# Altium schematic sheet soc-io.schdoc: IO
size A4; Date: 09.27.2026; CheckedBy: BCY; DrawnBy: miaow; Revision: v1.0.0; SheetNumber: 7; SheetTotal: 18; BoardType: MAIN_PCB; Desc: Connectivity
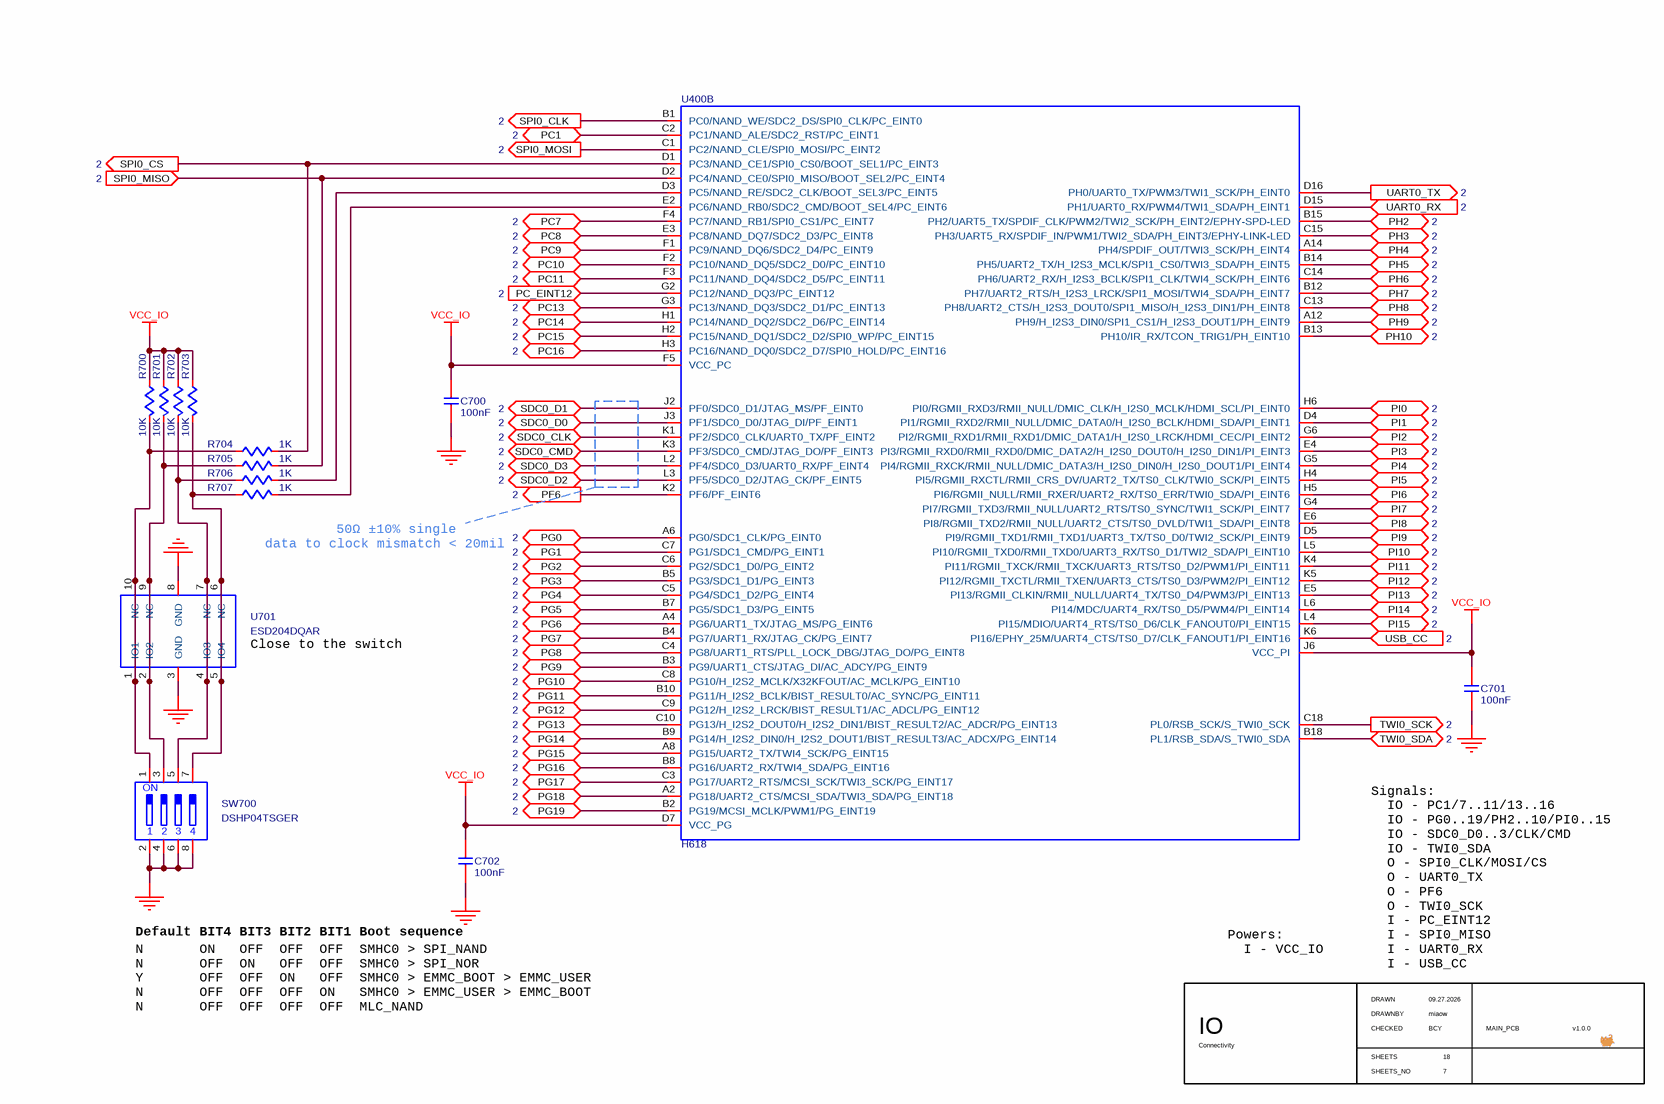
[diagram p0: soc-io.schdoc]

## Parts
C700  value 100nF  [C0201]  (hidden comment: C-NOMO)
C701  value 100nF  [C0201]  (hidden comment: C-NOMO)
C702  value 100nF  [C0201]  (hidden comment: C-NOMO)
R700  value 10K  [R0402]  (hidden comment: R)
R701  value 10K  [R0402]  (hidden comment: R)
R702  value 10K  [R0402]  (hidden comment: R)
R703  value 10K  [R0402]  (hidden comment: R)
R704  value 1K  [R0402]  (hidden comment: R)
R705  value 1K  [R0402]  (hidden comment: R)
R706  value 1K  [R0402]  (hidden comment: R)
R707  value 1K  [R0402]  (hidden comment: R)
SW700  DSHP04TSGER  [DSHP04TSGER]
U400  H618  [H618]  (part B of 4)
U701  ESD204DQAR  [ESD204DQAR]

## Ports
PC1 (bidir, see 2), PC7 (bidir, see 2), PC8 (bidir, see 2), PC9 (bidir, see 2), PC10 (bidir, see 2), PC11 (bidir, see 2), PC13 (bidir, see 2), PC14 (bidir, see 2), PC15 (bidir, see 2), PC16 (bidir, see 2), PC_EINT12 (in, see 2), PF6 (out, see 2), PG0 (bidir, see 2), PG1 (bidir, see 2), PG2 (bidir, see 2), PG3 (bidir, see 2), PG4 (bidir, see 2), PG5 (bidir, see 2), PG6 (bidir, see 2), PG7 (bidir, see 2), PG8 (bidir, see 2), PG9 (bidir, see 2), PG10 (bidir, see 2), PG11 (bidir, see 2), PG12 (bidir, see 2), PG13 (bidir, see 2), PG14 (bidir, see 2), PG15 (bidir, see 2), PG16 (bidir, see 2), PG17 (bidir, see 2), PG18 (bidir, see 2), PG19 (bidir, see 2), PH2 (bidir, see 2), PH3 (bidir, see 2), PH4 (bidir, see 2), PH5 (bidir, see 2), PH6 (bidir, see 2), PH7 (bidir, see 2), PH8 (bidir, see 2), PH9 (bidir, see 2), PH10 (bidir, see 2), PI0 (bidir, see 2), PI1 (bidir, see 2), PI2 (bidir, see 2), PI3 (bidir, see 2), PI4 (bidir, see 2), PI5 (bidir, see 2), PI6 (bidir, see 2), PI7 (bidir, see 2), PI8 (bidir, see 2), PI9 (bidir, see 2), PI10 (bidir, see 2), PI11 (bidir, see 2), PI12 (bidir, see 2), PI13 (bidir, see 2), PI14 (bidir, see 2), PI15 (bidir, see 2), SDC0_CLK (bidir, see 2), SDC0_CMD (bidir, see 2), SDC0_D0 (bidir, see 2), SDC0_D1 (bidir, see 2), SDC0_D2 (bidir, see 2), SDC0_D3 (bidir, see 2), SPI0_CLK (out, see 2), SPI0_CS (out, see 2), SPI0_MISO (in, see 2), SPI0_MOSI (out, see 2), TWI0_SCK (out, see 2), TWI0_SDA (bidir, see 2), UART0_RX (in, see 2), UART0_TX (out, see 2), USB_CC (in, see 2)

## Nets
GND: C700.2 C701.2 C702.2 SW700.2 SW700.4 SW700.6 SW700.8 U701.3(GND) U701.8(GND)
VCC_IO: C700.1 C701.1 C702.1 R700.2 R701.2 R702.2 R703.2 U400.D7(VCC_PG) U400.F5(VCC_PC) U400.J6(VCC_PI)
PC1: U400.C2(PC1/NAND_ALE/SDC2_RST/PC_EINT1) ; port PC1
PC7: U400.F4(PC7/NAND_RB1/SPI0_CS1/PC_EINT7) ; port PC7
PC8: U400.E3(PC8/NAND_DQ7/SDC2_D3/PC_EINT8) ; port PC8
PC9: U400.F1(PC9/NAND_DQ6/SDC2_D4/PC_EINT9) ; port PC9
PC10: U400.F2(PC10/NAND_DQ5/SDC2_D0/PC_EINT10) ; port PC10
PC11: U400.F3(PC11/NAND_DQ4/SDC2_D5/PC_EINT11) ; port PC11
PC13: U400.G3(PC13/NAND_DQ3/SDC2_D1/PC_EINT13) ; port PC13
PC14: U400.H1(PC14/NAND_DQ2/SDC2_D6/PC_EINT14) ; port PC14
PC15: U400.H2(PC15/NAND_DQ1/SDC2_D2/SPI0_WP/PC_EINT15) ; port PC15
PC16: U400.H3(PC16/NAND_DQ0/SDC2_D7/SPI0_HOLD/PC_EINT16) ; port PC16
PC_EINT12: U400.G2(PC12/NAND_DQ3/PC_EINT12) ; port PC_EINT12
PF6: U400.K2(PF6/PF_EINT6) ; port PF6
PG0: U400.A6(PG0/SDC1_CLK/PG_EINT0) ; port PG0
PG1: U400.C7(PG1/SDC1_CMD/PG_EINT1) ; port PG1
PG2: U400.C6(PG2/SDC1_D0/PG_EINT2) ; port PG2
PG3: U400.B5(PG3/SDC1_D1/PG_EINT3) ; port PG3
PG4: U400.C5(PG4/SDC1_D2/PG_EINT4) ; port PG4
PG5: U400.B7(PG5/SDC1_D3/PG_EINT5) ; port PG5
PG6: U400.A4(PG6/UART1_TX/JTAG_MS/PG_EINT6) ; port PG6
PG7: U400.B4(PG7/UART1_RX/JTAG_CK/PG_EINT7) ; port PG7
PG8: U400.C4(PG8/UART1_RTS/PLL_LOCK_DBG/JTAG_DO/PG_EINT8) ; port PG8
PG9: U400.B3(PG9/UART1_CTS/JTAG_DI/AC_ADCY/PG_EINT9) ; port PG9
PG10: U400.C8(PG10/H_I2S2_MCLK/X32KFOUT/AC_MCLK/PG_EINT10) ; port PG10
PG11: U400.B10(PG11/H_I2S2_BCLK/BIST_RESULT0/AC_SYNC/PG_EINT11) ; port PG11
PG12: U400.C9(PG12/H_I2S2_LRCK/BIST_RESULT1/AC_ADCL/PG_EINT12) ; port PG12
PG13: U400.C10(PG13/H_I2S2_DOUT0/H_I2S2_DIN1/BIST_RESULT2/AC_ADCR/PG_EINT13) ; port PG13
PG14: U400.B9(PG14/H_I2S2_DIN0/H_I2S2_DOUT1/BIST_RESULT3/AC_ADCX/PG_EINT14) ; port PG14
PG15: U400.A8(PG15/UART2_TX/TWI4_SCK/PG_EINT15) ; port PG15
PG16: U400.B8(PG16/UART2_RX/TWI4_SDA/PG_EINT16) ; port PG16
PG17: U400.C3(PG17/UART2_RTS/MCSI_SCK/TWI3_SCK/PG_EINT17) ; port PG17
PG18: U400.A2(PG18/UART2_CTS/MCSI_SDA/TWI3_SDA/PG_EINT18) ; port PG18
PG19: U400.B2(PG19/MCSI_MCLK/PWM1/PG_EINT19) ; port PG19
PH2: U400.B15(PH2/UART5_TX/SPDIF_CLK/PWM2/TWI2_SCK/PH_EINT2/EPHY-SPD-LED) ; port PH2
PH3: U400.C15(PH3/UART5_RX/SPDIF_IN/PWM1/TWI2_SDA/PH_EINT3/EPHY-LINK-LED) ; port PH3
PH4: U400.A14(PH4/SPDIF_OUT/TWI3_SCK/PH_EINT4) ; port PH4
PH5: U400.B14(PH5/UART2_TX/H_I2S3_MCLK/SPI1_CS0/TWI3_SDA/PH_EINT5) ; port PH5
PH6: U400.C14(PH6/UART2_RX/H_I2S3_BCLK/SPI1_CLK/TWI4_SCK/PH_EINT6) ; port PH6
PH7: U400.B12(PH7/UART2_RTS/H_I2S3_LRCK/SPI1_MOSI/TWI4_SDA/PH_EINT7) ; port PH7
PH8: U400.C13(PH8/UART2_CTS/H_I2S3_DOUT0/SPI1_MISO/H_I2S3_DIN1/PH_EINT8) ; port PH8
PH9: U400.A12(PH9/H_I2S3_DIN0/SPI1_CS1/H_I2S3_DOUT1/PH_EINT9) ; port PH9
PH10: U400.B13(PH10/IR_RX/TCON_TRIG1/PH_EINT10) ; port PH10
PI0: U400.H6(PI0/RGMII_RXD3/RMII_NULL/DMIC_CLK/H_I2S0_MCLK/HDMI_SCL/PI_EINT0) ; port PI0
PI1: U400.D4(PI1/RGMII_RXD2/RMII_NULL/DMIC_DATA0/H_I2S0_BCLK/HDMI_SDA/PI_EINT1) ; port PI1
PI2: U400.G6(PI2/RGMII_RXD1/RMII_RXD1/DMIC_DATA1/H_I2S0_LRCK/HDMI_CEC/PI_EINT2) ; port PI2
PI3: U400.E4(PI3/RGMII_RXD0/RMII_RXD0/DMIC_DATA2/H_I2S0_DOUT0/H_I2S0_DIN1/PI_EINT3) ; port PI3
PI4: U400.G5(PI4/RGMII_RXCK/RMII_NULL/DMIC_DATA3/H_I2S0_DIN0/H_I2S0_DOUT1/PI_EINT4) ; port PI4
PI5: U400.H4(PI5/RGMII_RXCTL/RMII_CRS_DV/UART2_TX/TS0_CLK/TWI0_SCK/PI_EINT5) ; port PI5
PI6: U400.H5(PI6/RGMII_NULL/RMII_RXER/UART2_RX/TS0_ERR/TWI0_SDA/PI_EINT6) ; port PI6
PI7: U400.G4(PI7/RGMII_TXD3/RMII_NULL/UART2_RTS/TS0_SYNC/TWI1_SCK/PI_EINT7) ; port PI7
PI8: U400.E6(PI8/RGMII_TXD2/RMII_NULL/UART2_CTS/TS0_DVLD/TWI1_SDA/PI_EINT8) ; port PI8
PI9: U400.D5(PI9/RGMII_TXD1/RMII_TXD1/UART3_TX/TS0_D0/TWI2_SCK/PI_EINT9) ; port PI9
PI10: U400.L5(PI10/RGMII_TXD0/RMII_TXD0/UART3_RX/TS0_D1/TWI2_SDA/PI_EINT10) ; port PI10
PI11: U400.K4(PI11/RGMII_TXCK/RMII_TXCK/UART3_RTS/TS0_D2/PWM1/PI_EINT11) ; port PI11
PI12: U400.K5(PI12/RGMII_TXCTL/RMII_TXEN/UART3_CTS/TS0_D3/PWM2/PI_EINT12) ; port PI12
PI13: U400.E5(PI13/RGMII_CLKIN/RMII_NULL/UART4_TX/TS0_D4/PWM3/PI_EINT13) ; port PI13
PI14: U400.L6(PI14/MDC/UART4_RX/TS0_D5/PWM4/PI_EINT14) ; port PI14
PI15: U400.L4(PI15/MDIO/UART4_RTS/TS0_D6/CLK_FANOUT0/PI_EINT15) ; port PI15
SDC0_CLK: U400.K1(PF2/SDC0_CLK/UART0_TX/PF_EINT2) ; port SDC0_CLK
SDC0_CMD: U400.K3(PF3/SDC0_CMD/JTAG_DO/PF_EINT3) ; port SDC0_CMD
SDC0_D0: U400.J3(PF1/SDC0_D0/JTAG_DI/PF_EINT1) ; port SDC0_D0
SDC0_D1: U400.J2(PF0/SDC0_D1/JTAG_MS/PF_EINT0) ; port SDC0_D1
SDC0_D2: U400.L3(PF5/SDC0_D2/JTAG_CK/PF_EINT5) ; port SDC0_D2
SDC0_D3: U400.L2(PF4/SDC0_D3/UART0_RX/PF_EINT4) ; port SDC0_D3
SPI0_CLK: U400.B1(PC0/NAND_WE/SDC2_DS/SPI0_CLK/PC_EINT0) ; port SPI0_CLK
SPI0_CS: R704.1 U400.D1(PC3/NAND_CE1/SPI0_CS0/BOOT_SEL1/PC_EINT3) ; port SPI0_CS
SPI0_MISO: R705.1 U400.D2(PC4/NAND_CE0/SPI0_MISO/BOOT_SEL2/PC_EINT4) ; port SPI0_MISO
SPI0_MOSI: U400.C1(PC2/NAND_CLE/SPI0_MOSI/PC_EINT2) ; port SPI0_MOSI
TWI0_SCK: U400.C18(PL0/RSB_SCK/S_TWI0_SCK) ; port TWI0_SCK
TWI0_SDA: U400.B18(PL1/RSB_SDA/S_TWI0_SDA) ; port TWI0_SDA
UART0_RX: U400.D15(PH1/UART0_RX/PWM4/TWI1_SDA/PH_EINT1) ; port UART0_RX
UART0_TX: U400.D16(PH0/UART0_TX/PWM3/TWI1_SCK/PH_EINT0) ; port UART0_TX
USB_CC: U400.K6(PI16/EPHY_25M/UART4_CTS/TS0_D7/CLK_FANOUT1/PI_EINT16) ; port USB_CC
NetR700_1: R700.1 R704.2 SW700.1 U701.1(IO1) U701.10(NC)
NetR701_1: R701.1 R705.2 SW700.3 U701.2(IO2) U701.9(NC)
NetR702_1: R702.1 R706.2 SW700.5 U701.4(IO3) U701.7(NC)
NetR703_1: R703.1 R707.2 SW700.7 U701.5(IO4) U701.6(NC)
NetR706_1: R706.1 U400.D3(PC5/NAND_RE/SDC2_CLK/BOOT_SEL3/PC_EINT5)
NetR707_1: R707.1 U400.E2(PC6/NAND_RB0/SDC2_CMD/BOOT_SEL4/PC_EINT6)

## Notes on the sheet
- data to clock mismatch < 20mil
- 50Ω ±10% single
- (near U701) Close to the switch
- Default BIT4 BIT3 BIT2 BIT1 Boot sequence
- Powers:
  I - VCC_IO
- Signals:
  IO - PC1/7..11/13..16
  IO - PG0..19/PH2..10/PI0..15
  IO - SDC0_D0..3/CLK/CMD
  IO - TWI0_SDA
  O - SPI0_CLK/MOSI/CS
  O - UART0_TX
  O - PF6
  O - TWI0_SCK
  I - PC_EINT12
  I - SPI0_MISO
  I - UART0_RX
  I - USB_CC
- N       ON   OFF  OFF  OFF  SMHC0 > SPI_NAND
  N       OFF  ON   OFF  OFF  SMHC0 > SPI_NOR
  Y       OFF  OFF  ON   OFF  SMHC0 > EMMC_BOOT > EMMC_USER
  N       OFF  OFF  OFF  ON   SMHC0 > EMMC_USER > EMMC_BOOT
  N       OFF  OFF  OFF  OFF  MLC_NAND
- DRAWN
- CHECKED
- DRAWNBY
- SHEETS
- SHEETS_NO
- (in symbol DSHP04TSGER) ON

## Library data of the parts
C700-C702 = C-NOMO: voltage: 10V; precision: 10%; Supplier 1: LCSC; Supplier Part Number 1: C49062
R700-R707 = R: precision: 1%; Supplier 1: LCSC
  R700-R703: Supplier Part Number 1: C25744
  R704-R707: Supplier Part Number 1: C11702
U400 = H618: SOC; Supplier 1: LCSC; Supplier Part Number 1: C19189292
U701 = ESD204DQAR: TVS/ESD - 4 ch, 3.6V, 5V, 0.55pF@1MHz, 30KV; Supplier 1: LCSC; Supplier Part Number 1: C553132
SW700 = DSHP04TSGER: Supplier 1: LCSC; Supplier Part Number 1: C3293144